# Altium project Audio_Research.PrjPcb (part 6 of 6)

## Sheet SD_Card.SchDoc: Audio Research: SD Card
size A4; DrawnBy: Connor Dack; Engineer: Connor Dack; DocumentNumber: 9; Revision: 1.0; SheetNumber: 9; SheetTotal: 20
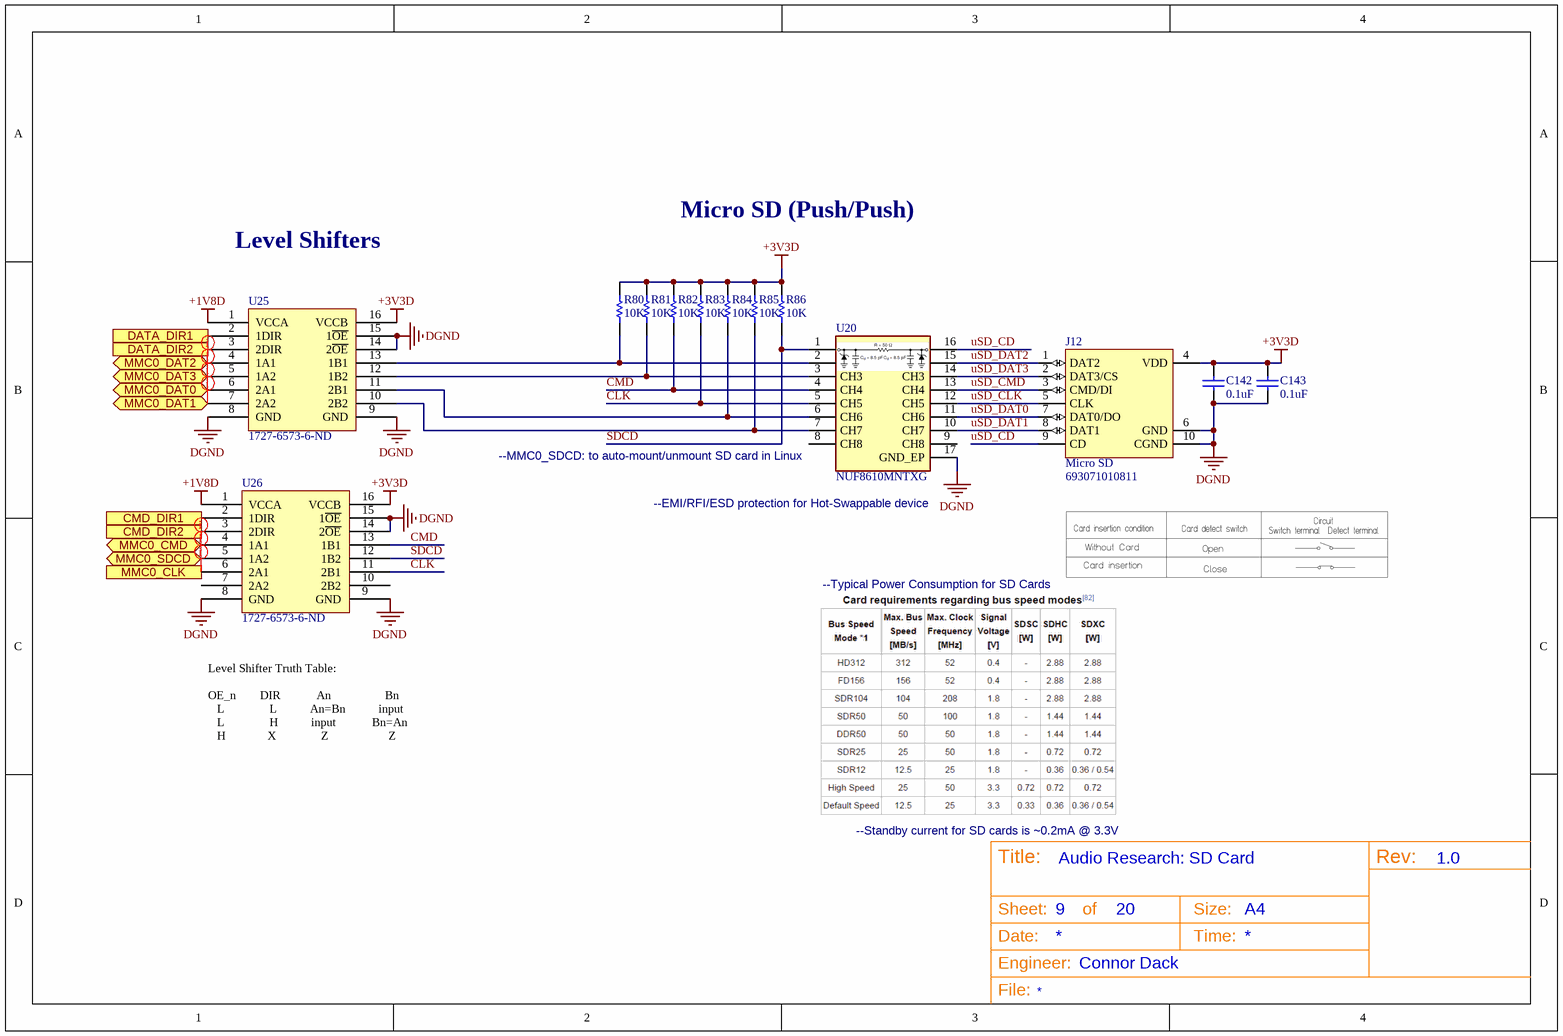
[diagram p19: SD_Card.SchDoc]

### Parts
C142  Capacitance: 0.1uF  [3-0603_L]  (hidden comment: CL10F104ZO8NNNC)
C143  Capacitance: 0.1uF  [3-0603_L]  (hidden comment: CL10F104ZO8NNNC)
J12  Micro SD  [693071010811]
R80  Resistance (Ohms): 10K  [2-0402_R_L]  (hidden comment: ERJ-2GEJ103X)
R81  Resistance (Ohms): 10K  [2-0402_R_L]  (hidden comment: ERJ-2GEJ103X)
R82  Resistance (Ohms): 10K  [2-0402_R_L]  (hidden comment: ERJ-2GEJ103X)
R83  Resistance (Ohms): 10K  [2-0402_R_L]  (hidden comment: ERJ-2GEJ103X)
R84  Resistance (Ohms): 10K  [2-0402_R_L]  (hidden comment: ERJ-2GEJ103X)
R85  Resistance (Ohms): 10K  [2-0402_R_L]  (hidden comment: ERJ-2GEJ103X)
R86  Resistance (Ohms): 10K  [2-0402_R_L]  (hidden comment: ERJ-2GEJ103X)
U20  NUF8610MNTXG  [ONSC-DFN-16-506AC_V]
U25  Supplier Part Number 1: 1727-6573-6-ND  [TSOP65P640X120-16N]  (hidden comment: IC TXRX 4BIT DUAL 3ST 16TSSOP)
U26  Supplier Part Number 1: 1727-6573-6-ND  [TSOP65P640X120-16N]  (hidden comment: IC TXRX 4BIT DUAL 3ST 16TSSOP)

### Ports
CMD_DIR1 (in), CMD_DIR2 (in), DATA_DIR1 (in), DATA_DIR2 (in), MMC0_CLK (in), MMC0_CMD (bidir), MMC0_DAT0 (bidir), MMC0_DAT1 (bidir), MMC0_DAT2 (bidir), MMC0_DAT3 (bidir), MMC0_SDCD (bidir)

### Nets
+1V8D: U25.1(VCCA) U26.1(VCCA)
+3V3D: C142.1 C143.1 J12.4(VDD) R80.2 R81.2 R82.2 R83.2 R84.2 R85.2 R86.2 U25.16(VCCB) U26.16(VCCB)
DGND: C142.2 C143.2 J12.6(GND) J12.10(CGND) U20.17(GND_EP) U25.8(GND) U25.9(GND) U25.14(2~{OE}) U25.15(1~{OE}) U26.8(GND) U26.9(GND) U26.14(2~{OE}) U26.15(1~{OE})  [project net AGND]
CLK: R83.1 U20.5(CH5) U26.11(2B1)
CMD: R82.1 U20.4(CH4) U26.13(1B1)
CMD_DIR1: U26.2(1DIR) ; port CMD_DIR1
CMD_DIR2: U26.3(2DIR) ; port CMD_DIR2
DATA_DIR1: U25.2(1DIR) ; port DATA_DIR1
DATA_DIR2: U25.3(2DIR) ; port DATA_DIR2
MMC0_CLK: U26.6(2A1) ; port MMC0_CLK
MMC0_CMD: U26.4(1A1) ; port MMC0_CMD
MMC0_DAT0: U25.6(2A1) ; port MMC0_DAT0
MMC0_DAT1: U25.7(2A2) ; port MMC0_DAT1
MMC0_DAT2: U25.4(1A1) ; port MMC0_DAT2
MMC0_DAT3: U25.5(1A2) ; port MMC0_DAT3
MMC0_SDCD: U26.5(1A2) ; port MMC0_SDCD
SDCD: R86.1 U20.1(CH1) U26.12(1B2)
uSD_CD: J12.9(CD) U20.16(CH1)
uSD_CLK: J12.5(CLK) U20.12(CH5)
uSD_CMD: J12.3(CMD/DI) U20.13(CH4)
uSD_DAT0: J12.7(DAT0/DO) U20.11(CH6)
uSD_DAT1: J12.8(DAT1) U20.10(CH7)
uSD_DAT2: J12.1(DAT2) U20.15(CH2)
uSD_DAT3: J12.2(DAT3/CS) U20.14(CH3)
NetR80_1: R80.1 U20.2(CH2) U25.13(1B1)
NetR81_1: R81.1 U20.3(CH3) U25.12(1B2)
NetR84_1: R84.1 U20.6(CH6) U25.11(2B1)
NetR85_1: R85.1 U20.7(CH7) U25.10(2B2)

Not connected (* = marked no-connect by the designer): U20 8(CH8) 9(CH8); U26 7(2A2) 10(2B2)

### Layout directives
net class SD_CARD: MMC0_CLK, MMC0_CMD, MMC0_DAT0, MMC0_DAT1, MMC0_DAT2, MMC0_DAT3, MMC0_SDCD

### Notes on the sheet
- Level Shifters
- Micro SD (Push/Push)
- (near U20) --MMC0_SDCD: to auto-mount/unmount SD card in Linux
- (near U20) --EMI/RFI/ESD protection for Hot-Swappable device
- --Typical Power Consumption for SD Cards
- Level Shifter Truth Table:
  OE_n        DIR            An                  Bn
  L               L           An=Bn           input
  L               H           input            Bn=An
  H              X               Z                    Z
- --Standby current for SD cards is ~0.2mA @ 3.3V
- Title:
- Sheet:
- of
- Size:
- A4
- Rev:
- Date:
- Engineer:
- Time:
- File:

### Library data of the parts
C142 C143 = CL10F104ZO8NNNC: CAP CER 0.1UF 16V Y5V 0603; Manufacturer: Samsung; Tolerance: 80%; Supplier 1: Digi-Key; Stock 1: 40000; Pricing 1: 1=0.1, 10=0.038, 100=0.0169, 500=0.01208, 1000=0.00949 (USD); Mount: Surface Mount; Case/Package: 0603; Case Code (Metric): 1608; Case Code (Imperial): 0603; Min Operating Temperature: -30°C; Max Operating Temperature: 85°C; Package Quantity: 1; Packaging: Tape and Reel; Voltage Rating: 16V; Dielectric: Y5V; Length: 1.6mm; Height: 0.8mm; Width: 0.031inch; Thickness: 0.035inch; Depth: 0.8mm; Radiation Hardening: No; ComponentLink1URL: https://datasheet.ciiva.com/25805/cl10f104zo8nnnc-25805810.pdf; ComponentLink1Description: https://datasheet.ciiva.com/25805/cl10f104zo8nnnc-25805810.pdf; ComponentLink2URL: https://datasheet.ciiva.com/16199/cl10f104zo8nnnc-16199254.pdf; ComponentLink2Description: https://datasheet.ciiva.com/16199/cl10f104zo8nnnc-16199254.pdf; Supplier Part Number 1: 1276-1258-6-ND; Manufacturer Part Number: CL10F104ZO8NNNC
J12 = 693071010811_mmc: CONN MICRO SD 8 POS SMD; Manufacturer: Wurth Electronics Inc; Number of Positions: 9 (8 + 1); Connector Type: Connector and Ejector; Insertion, Removal Method: Push In, Push Out; Card Type: Secure Digital - microSD; Supplier 1: Digi-Key; RoHS: RoHS Compliant; Category: Connectors, Interconnects; Stock 1: 6758; Pricing 1: 1=3.32, 10=3.188, 50=2.805, 100=2.6775, 500=2.295, 1400=2.10375 (USD); Packaging: Cut Tape (CT); Ejector Side: -; Mounting Type: Surface Mount, Right Angle; Features: Switch; Height Above Board: 0.072" (1.83mm); Mounting Feature: Normal, Standard - Top; Contact Finish: Gold; Contact Finish Thickness: -; ComponentLink1URL: http://katalog.we-online.de/em/datasheet/693071010811.pdf; ComponentLink1Description: http://katalog.we-online.de/em/datasheet/693071010811.pdf; Supplier Part Number 1: 732-3819-1-ND; Manufacturer Part Number: 693071010811
R80-R86 = ERJ-2GEJ103X: RES 10K OHM 1/10W 5% 0402 SMD; Manufacturer: Panasonic - ECG; Power (Watts): 0.1W, 1/10W; Temperature Coefficient: ±200ppm/°C; Supplier 1: Digi-Key; Manufacturer Part Number: ERJ-2GEJ103X; RoHS: RoHS Compliant; Category: Resistors; Stock 1: 2765902; Pricing 1: 1=0.05, 50=0.0172, 100=0.0131, 250=0.00976, 500=0.0072, 1000=0.0048, 5000=0.00338 (USD); Composition: Thick Film; Features: -; Tolerance: ±5%; Package / Case: 0402 (1005 Metric); Size / Dimension: 0.039" L x 0.020" W (1.00mm x 0.50mm); Height: 0.016" (0.40mm); Number of Terminations: 2; Packaging: Cut Tape (CT); ComponentLink1URL: http://industrial.panasonic.com/www-cgi/jvcr13pz.cgi?E+PZ+3+AOA0001+ERJ2GEJ103X+7+WW; ComponentLink1Description: http://industrial.panasonic.com/www-cgi/jvcr13pz.cgi?E+PZ+3+AOA0001+ERJ2GEJ103X+7+WW; Supplier Part Number 1: P10KJCT-ND
U20 = NUF8610MNTXG: IC EMI FILTER 8CH 16-DFN; Manufacturer: ON Semiconductor; Number of Channels: 8; Attenuation Value: 15dB; ESD Protection: Yes; Capacitance: 8.5pF; Operating Supply Voltage: 5V; Number of Elements: 16; DC Resistance (DCR): 58R; Supplier 1: Digi-Key; Stock 1: 3186; Pricing 1: 1=0.47, 10=0.441, 25=0.4204, 50=0.4068, 100=0.3933, 250=0.373, 500=0.31194, 1000=0.2421 (USD); Packaging: Tape and Reel; Height: 0.039inch; ComponentLink1URL: https://datasheet.ciiva.com/1022/nuf8610-d-1022805.pdf; ComponentLink1Description: https://datasheet.ciiva.com/1022/nuf8610-d-1022805.pdf; Supplier Part Number 1: NUF8610MNTXGOSCT-ND; Manufacturer Part Number: NUF8610MNTXG; Case/Package: DFN; Number of Pins: 16; Contact Plating: Tin,Matte; Min Operating Temperature: -40°C; Max Operating Temperature: 85°C; Package Quantity: 4000; Termination: Flat; Length: 4mm; Width: 0.063inch; Depth: 1.6mm; Radiation Hardening: No; REACH SVHC: No SVHC; Lead Free: Lead Free; ComponentLink2URL: https://datasheet.ciiva.com/1022/nuf8610-d-1022806.pdf; ComponentLink2Description: https://datasheet.ciiva.com/1022/nuf8610-d-1022806.pdf; ComponentLink3URL: https://datasheet.ciiva.com/1022/nuf8610-d-1022807.pdf; ComponentLink3Description: https://datasheet.ciiva.com/1022/nuf8610-d-1022807.pdf; ComponentLink4URL: https://datasheet.ciiva.com/26019/nuf8610-d-26019159.pdf; ComponentLink4Description: https://datasheet.ciiva.com/26019/nuf8610-d-26019159.pdf; ComponentLink5URL: https://datasheet.ciiva.com/12395/nuf8610-d-116660-12395000.pdf; ComponentLink5Description: https://datasheet.ciiva.com/12395/nuf8610-d-116660-12395000.pdf; Voltage Rating (DC): 5V; Circuit Type: Filter; Number of Lines: 8; Halogen Free: Halogen Free
U25 U26 = 74AVC4T245PW,118: Voltage Level Translator Bidirectional 2 Circuit 2 Channel 380Mbps 16-TSSOP; Manufacturer: NXP Semiconductors; Max Supply Voltage: 3.6V; Min Supply Voltage: 800mV; Propagation Delay: 14.7ns; Number of Channels: 4; Number of Elements: 2; Logic Function: Transceiver,Translator; Low Level Output Current: 12mA; Turn-On Delay Time: 14.5ns; Polarity: Non-Inverting; High Level Output Current: -12mA; Quiescent Current: 70uA; Supplier 1: Digi-Key; Stock 1: 22627; Pricing 1: 1=0.9, 10=0.804, 100=0.6266, 500=0.51764, 1000=0.40866 (USD); Mount: Surface Mount; Case/Package: TSSOP; Number of Pins: 16; Contact Plating: Gold; Min Operating Temperature: -40°C; Max Operating Temperature: 125°C; Packaging: Tape and Reel; Package Quantity: 2500; Data Rate: 380Mbps; Number of Bits: 4; Number of Circuits: 2; Radiation Hardening: No; Lead Free: Lead Free; ComponentLink1URL: https://datasheet.ciiva.com/1900/74avc4t245-1900214.pdf; ComponentLink1Description: https://datasheet.ciiva.com/1900/74avc4t245-1900214.pdf; ComponentLink2URL: https://datasheet.ciiva.com/1900/74avc4t245-1900215.pdf; ComponentLink2Description: https://datasheet.ciiva.com/1900/74avc4t245-1900215.pdf; ComponentLink3URL: https://datasheet.ciiva.com/1900/74avc4t245-1900216.pdf; ComponentLink3Description: https://datasheet.ciiva.com/1900/74avc4t245-1900216.pdf; ComponentLink4URL: https://datasheet.ciiva.com/15086/getdatasheetpartid-442686-15086830.pdf; ComponentLink4Description: https://datasheet.ciiva.com/15086/getdatasheetpartid-442686-15086830.pdf; Manufacturer Part Number: 74AVC4T245PW,118

## Nets that join several sheets
+1V8D: Support (SW1.1 SW2.1 SW3.1 SW4.1), Power (C39.2 C40.2 R10.2), Audio_Input_Mic_Array (C115.1 U16.16), Audio_Input_Digitial_Mic (5 pins), LPC_Female_FMC (J1.G39 J1.H40), LPC_Male_FMC (J2.G39 J2.H40), Level_Shifters (9 pins), SD_Card (U25.1 U26.1)
+3V3A: Audio_Codec (10 pins), Power (5 pins)
+3V3D: Audio_Codec (6 pins), Audio_Output_Headphone (R64.2 R65.2), Power (C37.2 C38.2 R9.2), Audio_Input_Mic_Array (8 pins), LPC_Female_FMC (5 pins), LPC_Male_FMC (5 pins), Level_Shifters (7 pins), SD_Card (12 pins)
+5V0A: Audio_Input_Line_In (C58.2 C67.2 U8.8 U9.8), Audio_Output_Headphone (C123.2 U18.12), Power (20 pins), Audio_Output_Line_Out (C126.2 C128.1 U19.8 U19.14), Audio_Output_XLR1 (C130.1 C133.1 U21.12 U22.12), Audio_Output_XLR2 (C136.1 C139.1 U23.12 U24.12), Audio_Input_Mic_In (6 pins), Audio_Input_Mic_Preamp (6 pins)
+5V0D: Audio_Output_Headphone (C122.1 U18.20), Power (7 pins)
+12V0D: Power (8 pins), LPC_Female_FMC (9 pins), LPC_Male_FMC (J2.C35 J2.C37)
-5V0A: Audio_Input_Line_In (C51.2 C60.2 U8.4 U9.4), Power (C28.2 R6.2), Audio_Output_Line_Out (C127.2 C129.1 U19.10 U19.12), Audio_Output_XLR1 (C132.1 C135.1 U21.11 U22.11), Audio_Output_XLR2 (C138.1 C141.1 U23.11 U24.11), Audio_Input_Mic_In (C69.2 C84.2 U10.4 U11.4), Audio_Input_Mic_Preamp (12 pins)
AGND: Audio_Codec (25 pins), Audio_Input_Line_In (13 pins), Audio_Output_Headphone (10 pins), Support (8 pins), Power (40 pins), Audio_Output_Line_Out (8 pins), Audio_Output_XLR1 (20 pins), Audio_Output_XLR2 (20 pins), Audio_Input_Mic_In (20 pins), Audio_Input_Mic_Array (16 pins), Audio_Input_Mic_Preamp (30 pins), Audio_Input_Digitial_Mic (5 pins), LPC_Female_FMC (61 pins), LPC_Male_FMC (61 pins), Level_Shifters (20 pins), SD_Card (13 pins)
~{RST_CODEC_FPGA}: LPC_Female_FMC (J1.H13), LPC_Male_FMC (J2.H13), Level_Shifters (U3.14)
ABCLK: Audio_Codec (U1.28), Level_Shifters (U4.8)
ABCLK_FPGA: LPC_Female_FMC (J1.H5), LPC_Male_FMC (J2.H5), Level_Shifters (U4.16)
ALRCLK: Audio_Codec (U1.29), Level_Shifters (U4.7)
ALRCLK_FPGA: LPC_Female_FMC (J1.G22), LPC_Male_FMC (J2.G22), Level_Shifters (U4.17)
~{CS_AUDIO_CODEC}: Audio_Codec (R3.2 U1.35), Level_Shifters (U2.5)
~{CS_AUDIO_CODEC_FPGA}: LPC_Female_FMC (J1.G27), LPC_Male_FMC (J2.G27), Level_Shifters (U2.19)
~{CS_PRE_AMP}: Audio_Input_Mic_Preamp (U13.9 U14.9), Level_Shifters (U2.4)
~{CS_PRE_AMP_FPGA}: LPC_Female_FMC (J1.H26), LPC_Male_FMC (J2.H26), Level_Shifters (U2.20)
CMD_DIR1: LPC_Female_FMC (J1.C19), LPC_Male_FMC (J2.C19), SD_Card (U26.2)
CMD_DIR2: LPC_Female_FMC (J1.C18), LPC_Male_FMC (J2.C18), SD_Card (U26.3)
COUT: LPC_Female_FMC (J1.H23), LPC_Male_FMC (J2.H23), Level_Shifters (U4.20)
DATA_DIR1: LPC_Female_FMC (J1.C15), LPC_Male_FMC (J2.C15), SD_Card (U25.2)
DATA_DIR2: LPC_Female_FMC (J1.C14), LPC_Male_FMC (J2.C14), SD_Card (U25.3)
DBCLK: Audio_Codec (U1.21), Level_Shifters (U3.5)
DBCLK_FPGA: LPC_Female_FMC (J1.H4), LPC_Male_FMC (J2.H4), Level_Shifters (U3.19)
DIGITAL_MIC_CLK: Audio_Input_Digitial_Mic (U12.1 U17.1), LPC_Female_FMC (J1.D20), LPC_Male_FMC (J2.D20)
DIGITAL_MIC_DATA: Audio_Input_Digitial_Mic (U12.5 U17.5), LPC_Female_FMC (J1.D21), LPC_Male_FMC (J2.D21)
DLRCLK: Audio_Codec (U1.22), Level_Shifters (U3.4)
DLRCLK_FPGA: LPC_Female_FMC (J1.G18), LPC_Male_FMC (J2.G18), Level_Shifters (U3.20)
~{HEADPHONE_SD}: Audio_Output_Headphone (U18.6), Level_Shifters (U2.3)
~{HEADPHONE_SD_FPGA}: LPC_Female_FMC (J1.H28), LPC_Male_FMC (J2.H28), Level_Shifters (U2.21)
HP_OUT_DSDATA: Audio_Codec (U1.20), Level_Shifters (U3.6)
HP_OUT_DSDATA_FPGA: LPC_Female_FMC (J1.G16), LPC_Male_FMC (J2.G16), Level_Shifters (U3.18)
LED1: Support (R13.2), LPC_Female_FMC (J1.C7), LPC_Male_FMC (J2.C7)
LED2: Support (R14.2), LPC_Female_FMC (J1.D8), LPC_Male_FMC (J2.D8)
LED3: Support (R17.2), LPC_Female_FMC (J1.D9), LPC_Male_FMC (J2.D9)
LED4: Support (R18.2), LPC_Female_FMC (J1.C6), LPC_Male_FMC (J2.C6)
LINE_IN_DSDATA: Audio_Codec (U1.26), Level_Shifters (U4.10)
LINE_IN_DSDATA_FPGA: LPC_Female_FMC (J1.H19), LPC_Male_FMC (J2.H19), Level_Shifters (U4.14)
LINE_OUT_DSDATA: Audio_Codec (U1.19), Level_Shifters (U3.7)
LINE_OUT_DSDATA_FPGA: LPC_Female_FMC (J1.H16), LPC_Male_FMC (J2.H16), Level_Shifters (U3.17)
MCLKO: Audio_Codec (R1.2 U1.3), Level_Shifters (U4.3)
MCLKO_FPGA: LPC_Female_FMC (J1.G3), LPC_Male_FMC (J2.G3), Level_Shifters (U4.21)
MIC_IN_DSDATA: Audio_Codec (U1.27), Level_Shifters (U4.9)
MIC_IN_DSDATA_FPGA: LPC_Female_FMC (J1.H20), LPC_Male_FMC (J2.H20), Level_Shifters (U4.15)
MMC0_CLK: LPC_Female_FMC (J1.G7), LPC_Male_FMC (J2.G7), SD_Card (U26.6)
MMC0_CMD: LPC_Female_FMC (J1.G9), LPC_Male_FMC (J2.G9), SD_Card (U26.4)
MMC0_DAT0: LPC_Female_FMC (J1.G10), LPC_Male_FMC (J2.G10), SD_Card (U25.6)
MMC0_DAT1: LPC_Female_FMC (J1.H10), LPC_Male_FMC (J2.H10), SD_Card (U25.7)
MMC0_DAT2: LPC_Female_FMC (J1.H7), LPC_Male_FMC (J2.H7), SD_Card (U25.4)
MMC0_DAT3: LPC_Female_FMC (J1.H8), LPC_Male_FMC (J2.H8), SD_Card (U25.5)
MMC0_SDCD: LPC_Female_FMC (J1.G6), LPC_Male_FMC (J2.G6), SD_Card (U26.5)
NetC52_1: Audio_Codec (U1.58), Audio_Input_Line_In (C52.1 C55.2 R23.2)
NetC55_1: Audio_Codec (U1.57), Audio_Input_Line_In (C55.1 C57.2 R26.2)
NetC62_1: Audio_Codec (U1.60), Audio_Input_Line_In (C62.1 C64.2 R29.2)
NetC64_1: Audio_Codec (U1.59), Audio_Input_Line_In (C64.1 C66.2 R32.2)
NetC70_1: Audio_Input_Mic_In (C70.1 C76.2 R35.2), Audio_Input_Mic_Preamp (U14.23)
NetC76_1: Audio_Input_Mic_In (C76.1 C78.2 R39.2), Audio_Input_Mic_Preamp (U14.24)
NetC85_1: Audio_Input_Mic_In (C85.1 C90.2 R44.2), Audio_Input_Mic_Preamp (U13.23)
NetC90_1: Audio_Input_Mic_In (C90.1 C92.2 R48.2), Audio_Input_Mic_Preamp (U13.24)
NetC120_1: Audio_Codec (U1.36), Audio_Output_Headphone (C120.1)
NetC121_1: Audio_Codec (U1.37), Audio_Output_Headphone (C121.1)
NetC124_1: Audio_Codec (U1.38), Audio_Output_Headphone (C124.1)
NetC125_1: Audio_Codec (U1.39), Audio_Output_Headphone (C125.1)
NetJ1_C22: LPC_Female_FMC (J1.C22), LPC_Male_FMC (J2.C22)
NetJ1_C23: LPC_Female_FMC (J1.C23), LPC_Male_FMC (J2.C23)
NetJ1_C26: LPC_Female_FMC (J1.C26), LPC_Male_FMC (J2.C26)
NetJ1_C27: LPC_Female_FMC (J1.C27), LPC_Male_FMC (J2.C27)
NetJ1_C30: Audio_Output_Headphone (R64.1 U18.8), LPC_Female_FMC (J1.C30), LPC_Male_FMC (J2.C30)
NetJ1_C31: Audio_Output_Headphone (R65.1 U18.7), LPC_Female_FMC (J1.C31), LPC_Male_FMC (J2.C31)
NetJ1_C34: LPC_Female_FMC (J1.C34), LPC_Male_FMC (J2.C34)
NetJ1_D1: LPC_Female_FMC (J1.D1), LPC_Male_FMC (J2.D1)
NetJ1_D14: LPC_Female_FMC (J1.D14), LPC_Male_FMC (J2.D14)
NetJ1_D15: LPC_Female_FMC (J1.D15), LPC_Male_FMC (J2.D15)
NetJ1_D17: LPC_Female_FMC (J1.D17), LPC_Male_FMC (J2.D17)
NetJ1_D18: LPC_Female_FMC (J1.D18), LPC_Male_FMC (J2.D18)
NetJ1_D23: LPC_Female_FMC (J1.D23), LPC_Male_FMC (J2.D23)
NetJ1_D24: LPC_Female_FMC (J1.D24), LPC_Male_FMC (J2.D24)
NetJ1_D26: LPC_Female_FMC (J1.D26), LPC_Male_FMC (J2.D26)
NetJ1_D27: LPC_Female_FMC (J1.D27), LPC_Male_FMC (J2.D27)
NetJ1_D29: LPC_Female_FMC (J1.D29), LPC_Male_FMC (J2.D29)
NetJ1_D30: LPC_Female_FMC (J1.D30), LPC_Male_FMC (J2.D30)
NetJ1_D31: LPC_Female_FMC (J1.D31), LPC_Male_FMC (J2.D31)
NetJ1_D33: LPC_Female_FMC (J1.D33), LPC_Male_FMC (J2.D33)
NetJ1_D34: LPC_Female_FMC (J1.D34), LPC_Male_FMC (J2.D34)
NetJ1_D35: LPC_Female_FMC (J1.D35), LPC_Male_FMC (J2.D35)
NetJ1_G2: LPC_Female_FMC (J1.G2), LPC_Male_FMC (J2.G2)
NetJ1_G19: LPC_Female_FMC (J1.G19), LPC_Male_FMC (J2.G19)
NetJ1_G21: LPC_Female_FMC (J1.G21), LPC_Male_FMC (J2.G21)
NetJ1_G24: LPC_Female_FMC (J1.G24), LPC_Male_FMC (J2.G24)
NetJ1_G25: LPC_Female_FMC (J1.G25), LPC_Male_FMC (J2.G25)
NetJ1_G28: LPC_Female_FMC (J1.G28), LPC_Male_FMC (J2.G28), Level_Shifters (U2.17)
NetJ1_G30: LPC_Female_FMC (J1.G30), LPC_Male_FMC (J2.G30)
NetJ1_G31: LPC_Female_FMC (J1.G31), LPC_Male_FMC (J2.G31), Level_Shifters (U2.18)
NetJ1_G33: LPC_Female_FMC (J1.G33), LPC_Male_FMC (J2.G33)
NetJ1_G34: LPC_Female_FMC (J1.G34), LPC_Male_FMC (J2.G34)
NetJ1_G36: LPC_Female_FMC (J1.G36), LPC_Male_FMC (J2.G36)
NetJ1_G37: LPC_Female_FMC (J1.G37), LPC_Male_FMC (J2.G37)
NetJ1_H1: LPC_Female_FMC (J1.H1), LPC_Male_FMC (J2.H1)
NetJ1_H2: LPC_Female_FMC (J1.H2), LPC_Male_FMC (J2.H2)
NetJ1_H17: LPC_Female_FMC (J1.H17), LPC_Male_FMC (J2.H17)
NetJ1_H22: LPC_Female_FMC (J1.H22), LPC_Male_FMC (J2.H22)
NetJ1_H25: LPC_Female_FMC (J1.H25), LPC_Male_FMC (J2.H25)
NetJ1_H29: LPC_Female_FMC (J1.H29), LPC_Male_FMC (J2.H29)
NetJ1_H31: LPC_Female_FMC (J1.H31), LPC_Male_FMC (J2.H31)
NetJ1_H32: Audio_Input_Mic_Array (U16.11), LPC_Female_FMC (J1.H32), LPC_Male_FMC (J2.H32)
NetJ1_H34: Audio_Input_Mic_Array (U16.13), LPC_Female_FMC (J1.H34), LPC_Male_FMC (J2.H34)
NetJ1_H38: Audio_Input_Mic_Array (U16.10), LPC_Female_FMC (J1.H38), LPC_Male_FMC (J2.H38)
NetR68_1: Audio_Codec (U1.40), Audio_Output_Line_Out (R68.1)
NetR70_1: Audio_Codec (U1.41), Audio_Output_Line_Out (R70.1)
NetR71_1: Audio_Codec (U1.43), Audio_Output_Line_Out (R71.1)
NetR73_1: Audio_Codec (U1.42), Audio_Output_Line_Out (R73.1)
NetU1_6: Audio_Codec (U1.6), Audio_Output_XLR1 (U21.7)
NetU1_7: Audio_Codec (U1.7), Audio_Output_XLR1 (U21.6)
NetU1_8: Audio_Codec (U1.8), Audio_Output_XLR1 (U22.7)
NetU1_9: Audio_Codec (U1.9), Audio_Output_XLR1 (U22.6)
NetU1_10: Audio_Codec (U1.10), Audio_Output_XLR2 (U23.7)
NetU1_11: Audio_Codec (U1.11), Audio_Output_XLR2 (U23.6)
NetU1_12: Audio_Codec (U1.12), Audio_Output_XLR2 (U24.7)
NetU1_13: Audio_Codec (U1.13), Audio_Output_XLR2 (U24.6)
NetU1_53: Audio_Codec (U1.53), Audio_Input_Mic_Preamp (U14.15)
NetU1_54: Audio_Codec (U1.54), Audio_Input_Mic_Preamp (U14.14)
NetU1_55: Audio_Codec (U1.55), Audio_Input_Mic_Preamp (U13.15)
NetU1_56: Audio_Codec (U1.56), Audio_Input_Mic_Preamp (U13.14)
RJ45_LED1: Audio_Input_Mic_Array (R62.1), LPC_Female_FMC (J1.H35), LPC_Male_FMC (J2.H35)
RJ45_LED2: Audio_Input_Mic_Array (R63.1), LPC_Female_FMC (J1.H37), LPC_Male_FMC (J2.H37)
SCLK: Audio_Codec (U1.34), Audio_Input_Mic_Preamp (U13.10 U14.10), Level_Shifters (U2.6)
SDI: Audio_Codec (U1.30), Audio_Input_Mic_Preamp (U13.8), Level_Shifters (U2.7)
SDO: Audio_Codec (R5.2 U1.31), Audio_Input_Mic_Preamp (U14.11), Level_Shifters (U4.4)
SW1: Support (R15.1 SW1.2), LPC_Female_FMC (J1.C2), LPC_Male_FMC (J2.C2)
SW2: Support (R16.1 SW2.2), LPC_Female_FMC (J1.C3), LPC_Male_FMC (J2.C3)
SW3: Support (R19.1 SW3.2), LPC_Female_FMC (J1.D4), LPC_Male_FMC (J2.D4)
SW4: Support (R20.1 SW4.2), LPC_Female_FMC (J1.D5), LPC_Male_FMC (J2.D5)
XLR_1_OUT_DSDATA: Audio_Codec (U1.18), Level_Shifters (U3.8)
XLR_1_OUT_DSDATA_FPGA: LPC_Female_FMC (J1.G15), LPC_Male_FMC (J2.G15), Level_Shifters (U3.16)
XLR_2_OUT_DSDATA: Audio_Codec (U1.15), Level_Shifters (U3.9)
XLR_2_OUT_DSDATA_FPGA: LPC_Female_FMC (J1.H14), LPC_Male_FMC (J2.H14), Level_Shifters (U3.15)

## Assembly variants
BUILD: not fitted C25 C26 J1